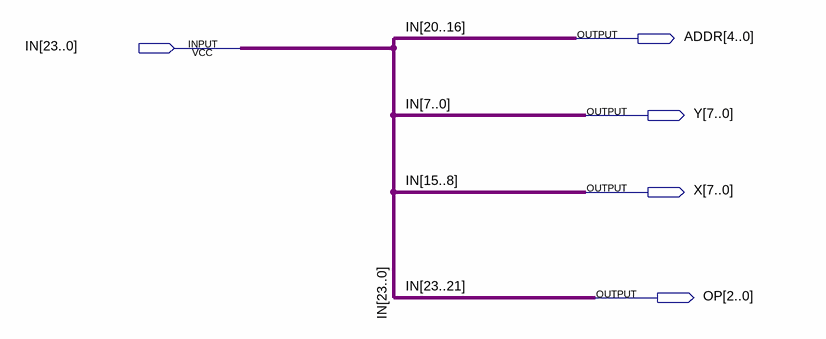
[diagram p0: schematic sheet]
// Quartus schematic Decoder.bdf as structural Verilog: 0 symbols, 5 pins
module Decoder (
  input  [23:0] IN,
  output [4:0] ADDR,
  output [7:0] Y,
  output [7:0] X,
  output [2:0] OP
);


  assign ADDR = IN[20:16];
  assign OP = IN[23:21];
  assign X = IN[15:8];
  assign Y = IN[7:0];
endmodule
